# EAGLE design SmartMatrix_V1 (EAGLE 7.2.0)
DATABASE: ./SmartMatrixMVP-PARTSDB.txt
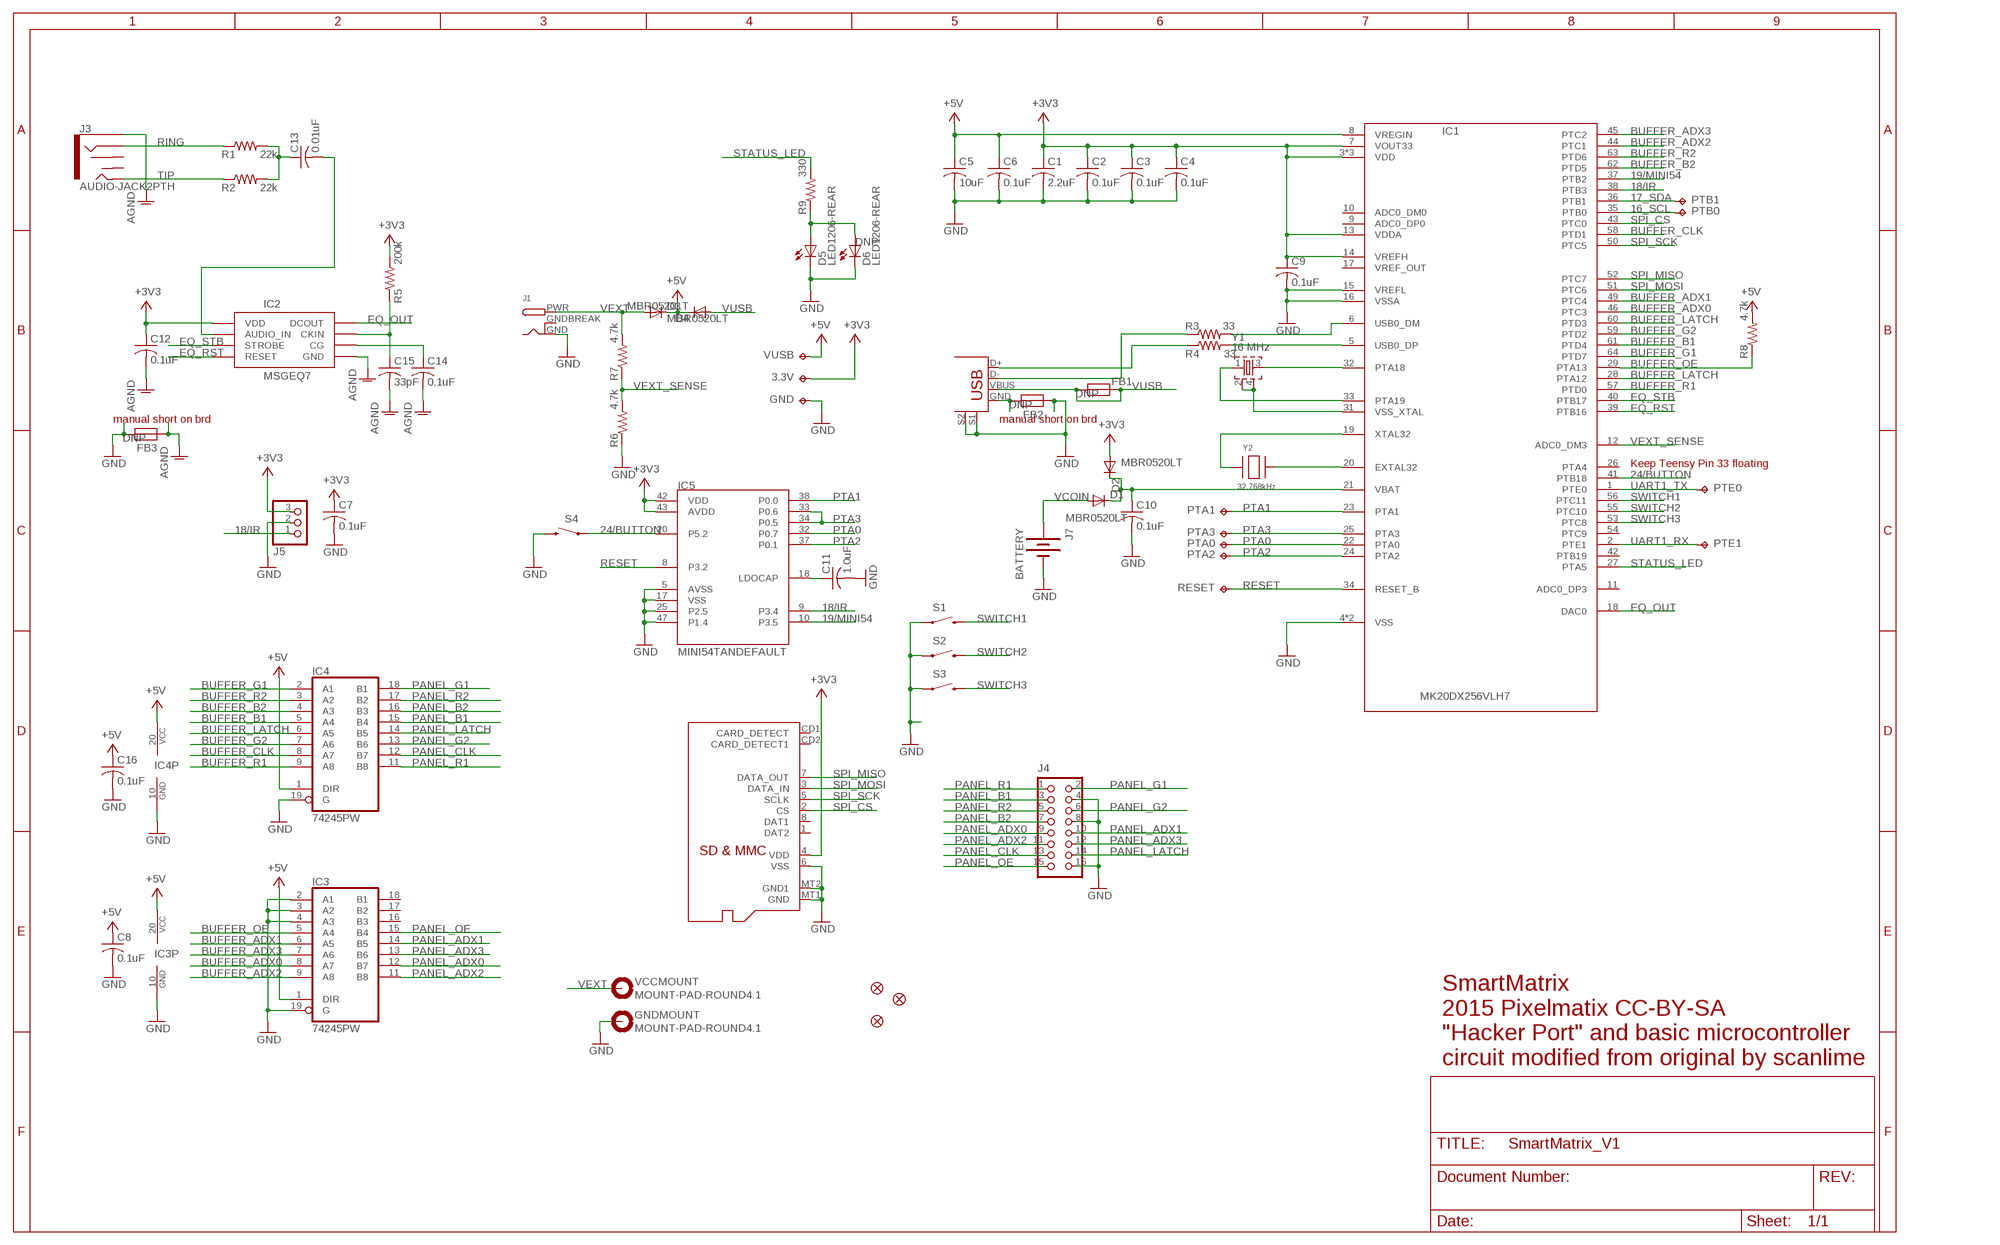
[diagram p0: schematic, sheet 1]

## Parts
3.3V  TPTP18SQ  [TP18SQ]
C1  2.2uF  C-US0805/NO-OUTLINE  [0805]
C2  0.1uF  C-US0805/NO-OUTLINE  [0805]
C3  0.1uF  C-US0805/NO-OUTLINE  [0805]
C4  0.1uF  C-US0805/NO-OUTLINE  [0805]
C5  10uF  C-US0805/NO-OUTLINE  [0805]
C6  0.1uF  C-US0805/NO-OUTLINE  [0805]
C7  0.1uF  C-US0805/NO-OUTLINE  [0805]
C8  0.1uF  C-US0805/NO-OUTLINE  [0805]
C9  0.1uF  C-US0805/NO-OUTLINE  [0805]
C10  0.1uF  C-US0805/NO-OUTLINE  [0805]
C11  1.0uF  C-US0805/NO-OUTLINE  [0805]
C12  0.1uF  C-US0805/NO-OUTLINE  [0805]
C13  0.01uF  C-US0805/NO-OUTLINE  [0805]
C14  0.1uF  C-US0805/NO-OUTLINE  [0805]
C15  33pF  C-US0805/NO-OUTLINE  [0805]
C16  0.1uF  C-US0805/NO-OUTLINE  [0805]
D1  MBR0520LT  [SOD123]
D2  MBR0520LT  [SOD123]
D3  MBR0520LT  [SOD123]
D4  MBR0520LT  [SOD123]
D5  LED1206-REAR  [LED-REARENTRY]
D6  LED1206-REAR  [LED-REARENTRY]
FB1  FB0805/NO-OUTLINE  [0805]
FB2  FB0805/NO-OUTLINE  [0805]
FB3  FB0805/NO-OUTLINE  [0805]
FID1  FIDUCIAL""  [FIDUCIAL_1MM]
FID2  FIDUCIAL""  [FIDUCIAL_1MM]
FID3  FIDUCIAL""  [FIDUCIAL_1MM]
GND  TPTP18SQ  [TP18SQ]
GNDMOUNT  MOUNT-PAD-ROUND4.1  [4,1-PAD]
IC1  MK20DX256VLH7  [MK20DX256VLH7]
IC2  MSGEQ7SOIC  [SOIC8]
IC3  74245PW  [TSSOP-20]
IC4  74245PW  [TSSOP-20]
IC5  MINI54TANDEFAULT  [QFP50P900X900X160-48N]
J1  DCBARRELPTH  [DCJACK_2MM_PTH]
J2  USB+SHIELD  [USB-B-PTH]
J3  AUDIO-JACK2PTH  [AUDIO-JACK]
J4  CON_HEADER_2X08NOA  [2X08-NOA]
J5  CON_HEADER_1X03SMD/90-NOA  [1X03-SMD/90-NOA]
J6  MICROSD  [MICROSD]
J7  BATTERY  [BU2032-SM]
PTA0  TPTP18SQ  [TP18SQ]
PTA1  TPTP18SQ  [TP18SQ]
PTA2  TPTP18SQ  [TP18SQ]
PTA3  TPTP18SQ  [TP18SQ]
PTB0  TPTP18SQ  [TP18SQ]
PTB1  TPTP18SQ  [TP18SQ]
PTE0  TPTP18SQ  [TP18SQ]
PTE1  TPTP18SQ  [TP18SQ]
R1  22k  R-US_0805/NO-OUTLINE  [0805]
R2  22k  R-US_0805/NO-OUTLINE  [0805]
R3  33  R-US_0805/NO-OUTLINE  [0805]
R4  33  R-US_0805/NO-OUTLINE  [0805]
R5  200k  R-US_0805/NO-OUTLINE  [0805]
R6  4.7k  R-US_0805/NO-OUTLINE  [0805]
R7  4.7k  R-US_0805/NO-OUTLINE  [0805]
R8  4.7k  R-US_0805/NO-OUTLINE  [0805]
R9  330  R-US_0805/NO-OUTLINE  [0805]
RESET  TPTP18SQ  [TP18SQ]
S1  SWITCH-MOMENTARY-2PTH  [TACTILE-PTH]
S2  SWITCH-MOMENTARY-2PTH  [TACTILE-PTH]
S3  SWITCH-MOMENTARY-2PTH  [TACTILE-PTH]
S4  SWITCH-MOMENTARY-2PTH  [TACTILE-PTH]
VCCMOUNT  MOUNT-PAD-ROUND4.1  [4,1-PAD]
VUSB  TPTP18SQ  [TP18SQ]
Y1  16 MHz  TSX-32250  [TSX-3225]
Y2  32.768kHz  XTAL-3.2X1.5  [XTAL3215]

## Nets
16_SCL: IC1.35(PTB0) PTB0.TP
17_SDA: IC1.36(PTB1) PTB1.TP
18/IR: IC1.38(PTB3) IC5.9(P3.4) J5.1
19/MINI54: IC1.37(PTB2) IC5.10(P3.5)
24/BUTTON: IC1.41(PTB18) IC5.20(P5.2) S4.1
+3V3: 3.3V.TP C1.1 C2.1 C3.1 C4.1 C7.1 C9.1 C12.1 D2.A IC1.3(VDD) IC1.7(VOUT33) IC1.13(VDDA) IC1.14(VREFH) IC1.30(VDD) IC1.48(VDD) IC2.1(VDD) IC5.42(VDD) IC5.43(AVDD) J5.3 J6.4(VDD) R5.2
+5V: C5.1 C6.1 C8.1 C16.1 D3.C D4.C IC1.8(VREGIN) IC3.1(DIR) IC3.20(VCC) IC4.1(DIR) IC4.20(VCC) R8.2 VUSB.TP
AGND [power]: C12.2 C14.2 C15.2 FB3.2 IC2.2(GND) J3.SLEEVE
BUFFER_ADX0: IC1.46(PTC3) IC3.8(A7)
BUFFER_ADX1: IC1.49(PTC4) IC3.6(A5)
BUFFER_ADX2: IC1.44(PTC1) IC3.9(A8)
BUFFER_ADX3: IC1.45(PTC2) IC3.7(A6)
BUFFER_B1: IC1.61(PTD4) IC4.5(A4)
BUFFER_B2: IC1.62(PTD5) IC4.4(A3)
BUFFER_CLK: IC1.58(PTD1) IC4.8(A7)
BUFFER_G1: IC1.64(PTD7) IC4.2(A1)
BUFFER_G2: IC1.59(PTD2) IC4.7(A6)
BUFFER_LATCH: IC1.28(PTA12) IC1.60(PTD3) IC4.6(A5)
BUFFER_OE: IC1.29(PTA13) IC3.5(A4) R8.1
BUFFER_R1: IC1.57(PTD0) IC4.9(A8)
BUFFER_R2: IC1.63(PTD6) IC4.3(A2)
EQ_OUT: IC1.18(DAC0) IC2.3(DCOUT)
EQ_RST: IC1.39(PTB16) IC2.7(RESET)
EQ_STB: IC1.40(PTB17) IC2.4(STROBE)
GND [power]: C1.2 C2.2 C3.2 C4.2 C5.2 C6.2 C7.2 C8.2 C9.2 C10.2 C11.2 C16.2 D5.-(C) D6.-(C) FB2.2 FB3.1 GND.TP GNDMOUNT.B4,1(MOUNT) IC1.4(VSS) IC1.15(VREFL) IC1.16(VSSA) IC1.47(VSS) IC3.2(A1) IC3.3(A2) IC3.4(A3) IC3.10(GND) IC3.19(G) IC4.10(GND) IC4.19(G) IC5.5(AVSS) IC5.17(VSS) IC5.25(P2.5) IC5.47(P1.4) J1.GND J2.S1 J2.S2 J4.4 J4.8 J4.16 J5.2 J6.6(VSS) J6.MT1(GND) J6.MT2(GND1) J7.- R6.1 S1.1 S2.1 S3.1 S4.3
N$1: C13.1 R1.2 R2.2
N$2: IC1.32(PTA18) Y1.3
N$3 [power]: FB2.1 J2.GND
N$4: IC1.33(PTA19) Y1.1
N$5: C13.2 IC2.5(AUDIO_IN)
N$8: D5.+(A) D6.+(A) R9.1
N$9: J2.D+ R4.1
N$10: J2.D- R3.1
N$11: IC1.6(USB0_DM) R3.2
N$12: IC1.5(USB0_DP) R4.2
N$15: IC1.19(XTAL32) Y2.P$1
N$16: IC1.20(EXTAL32) Y2.P$2
N$18: C15.1 IC2.8(CKIN) R5.1
N$19: C11.1 IC5.18(LDOCAP)
N$22: C14.1 IC2.6(CG)
PANEL_ADX0: IC3.12(B7) J4.9
PANEL_ADX1: IC3.14(B5) J4.10
PANEL_ADX2: IC3.11(B8) J4.11
PANEL_ADX3: IC3.13(B6) J4.12
PANEL_B1: IC4.15(B4) J4.3
PANEL_B2: IC4.16(B3) J4.7
PANEL_CLK: IC4.12(B7) J4.13
PANEL_G1: IC4.18(B1) J4.2
PANEL_G2: IC4.13(B6) J4.6
PANEL_LATCH: IC4.14(B5) J4.14
PANEL_OE: IC3.15(B4) J4.15
PANEL_R1: IC4.11(B8) J4.1
PANEL_R2: IC4.17(B2) J4.5
PTA0: IC1.22(PTA0) IC5.32(P0.7) PTA0.TP
PTA1: IC1.23(PTA1) IC5.38(P0.0) PTA1.TP
PTA2: IC1.24(PTA2) IC5.37(P0.1) PTA2.TP
PTA3: IC1.25(PTA3) IC5.33(P0.6) IC5.34(P0.5) PTA3.TP
RESET: IC1.34(RESET_B) IC5.8(P3.2) RESET.TP
RING: J3.RING R1.1
SPI_CS: IC1.43(PTC0) J6.2(CS)
SPI_MISO: IC1.52(PTC7) J6.7(DATA_OUT)
SPI_MOSI: IC1.51(PTC6) J6.3(DATA_IN)
SPI_SCK: IC1.50(PTC5) J6.5(SCLK)
STATUS_LED: IC1.27(PTA5) R9.2
SWITCH1: IC1.56(PTC11) S1.3
SWITCH2: IC1.55(PTC10) S2.3
SWITCH3: IC1.53(PTC8) S3.3
TIP: J3.TIP R2.1
UART1_RX: IC1.2(PTE1) PTE1.TP
UART1_TX: IC1.1(PTE0) PTE0.TP
VBAT: C10.1 D1.C D2.C IC1.21(VBAT)
VCOIN: D1.A J7.+
VEXT: D3.A J1.PWR R7.2 VCCMOUNT.B4,1(MOUNT)
VEXT_SENSE: IC1.12(ADC0_DM3) R6.2 R7.1
VUSB: D4.A FB1.1 FB1.2 J2.VBUS
XTAL_GND: IC1.31(VSS_XTAL) Y1.2 Y1.4
Unconnected: IC1.9(ADC0_DP0) IC1.10(ADC0_DM0) IC1.11(ADC0_DP3) IC1.17(VREF_OUT) IC1.26(PTA4) IC1.42(PTB19) IC1.54(PTC9) IC3.16(B3) IC3.17(B2) IC3.18(B1) J3.RSH J3.TSH J6.1(DAT2) J6.8(DAT1) J6.CD1(CARD_DETECT) J6.CD2(CARD_DETECT1)

## Notes on the sheet
- manual short on brd | manual short on brd
- Keep Teensy Pin 33 floating
- SmartMatrix
  2015 Pixelmatix CC-BY-SA
  "Hacker Port" and basic microcontroller
  circuit modified from original by scanlime

## Power pins joined to a net without a drawn wire
GNDBREAK: J1.GNDBREAK

## Library data of the parts
3.3V GND PTA0 PTA1-PTA3 PTB0 PTB1 PTE0 PTE1 RESET VUSB = testpad:TP: Test pad; BOM: EXCLUDE
C1 = scanlime:C-US: CAPACITOR, American symbol; PARTNO: CAP CER 2.2UF 10V 10% X7R 0805
C2-C4 C6-C10 C12 C14 C16 = scanlime:C-US: CAPACITOR, American symbol; PARTNO: CAP CER 0.1UF 10V 10% X7R 0805
C5 = scanlime:C-US: CAPACITOR, American symbol; PARTNO: CAP CER 10UF 10V 10% X5R 0805
C11 = scanlime:C-US: CAPACITOR, American symbol; DNP: T; PARTNO: CAP CER 1UF 10V X7R 0805
C13 = scanlime:C-US: CAPACITOR, American symbol; PARTNO: CAP CER 10000PF 50V 10% X7R 0805
C15 = scanlime:C-US: CAPACITOR, American symbol; PARTNO: CAP CER 33PF 50V 5% NP0 0805
D1-D4 = eclibrary:MBR0520LT: SCHOTTKY BARRIER RECTIFIER Source: http://onsemi.com .. MBR0520LT1-D.pdf; PARTNO: MBR0560-TP
D5 = eclibrary:LED; PARTNO: APTR3216YC
D6 = eclibrary:LED; DNP: T
FB1-FB3 = scanlime:FB; DNP: T; PARTNO: RES SMD 0.0 OHM JUMPER 1/8W 0805
FID1-FID3 = microbuilder:FIDUCIAL: Fiducial Alignment Points Various fiducial points for machine vision alignment.; BOM: EXCLUDE
GNDMOUNT VCCMOUNT = eclibrary:MOUNT-PAD-ROUND: MOUNTING PAD, round; BOM: EXCLUDE
IC1 = eclibrary:MK20DX256VLH7: Teensy 3.1 main microcontroller; PARTNO: MK20DX256VLH7
IC2 = msgeq7:MSGEQ7: 7-band graphic equalizer; PARTNO: MSGEQ7N
IC3 IC4 = eclibrary:74*245: Octal BUS TRANSCEIVER, 3-state; PARTNO: SN74AHCT245PWR
IC5 = Teensy_3_Series_Chip_v1.0:MINI54TAN: MINI54TAN Bootloader from PJRC.com, preprogrammed with Teensy 3.0 bootloader. https://www.pjrc.com/store/ic_mini54_tqfp.html; DNP: T
J1 = adafruit:DCBARREL: 2.0mm DC Barrel Jack DCJACK_2MM_PTH - Through Hole Jack (4UConnector: 05537); PARTNO: PJ-002AH
J2 = SparkFun:USB+SHIELD: USB+Shield USB connector with shield pins connectable; PARTNO: E8144-B02022-L
J3 = SparkFun:AUDIO-JACK2; PARTNO: SJ1-3553NG
J4 = eclibrary:CON_HEADER_2X08: 2x07 pin header; PARTNO: 11149
J5 = eclibrary:CON_HEADER_1X03; PARTNO: 11182
J6 = adafruit:MICROSD: Micro-SD / Transflash card holder with SPI pinout For the 3M # 2908-05WB-MG and/or 4UCON #19656 push-push type; PARTNO: 101-00660-68-6
J7 = eclibrary:BATTERY; PARTNO: 05581
R1 R2 = scanlime:R-US_: RESISTOR, American symbol; PARTNO: RES SMD 22K OHM 5% 1/8W 0805
R3 R4 = scanlime:R-US_: RESISTOR, American symbol; PARTNO: RES 33 OHM 1/8W 5% 0805 SMD
R5 = scanlime:R-US_: RESISTOR, American symbol; PARTNO: RES SMD 200K OHM 5% 1/8W 0805
R6-R8 = scanlime:R-US_: RESISTOR, American symbol; PARTNO: RES SMD 4.7K OHM 5% 1/8W 0805
R9 = scanlime:R-US_: RESISTOR, American symbol; PARTNO: RES SMD 330 OHM 5% 1/8W 0805
S1-S4 = SparkFun:SWITCH-MOMENTARY-2; DNP: T
Y1 = scanlime:TSX-3225: MHz RANGE CRYSTAL UNIT Source: Epson Toyocom; PARTNO: TSX-3225 16.0000MF09Z-AC3
Y2 = adafruit:XTAL: Low cost SMT crystals, no capacitors included http://www.ladyada.net/library/eagle; PARTNO: 9HT10-32.768KDZF-T

## Net classes
1 power: width 0.406 mm

## Board
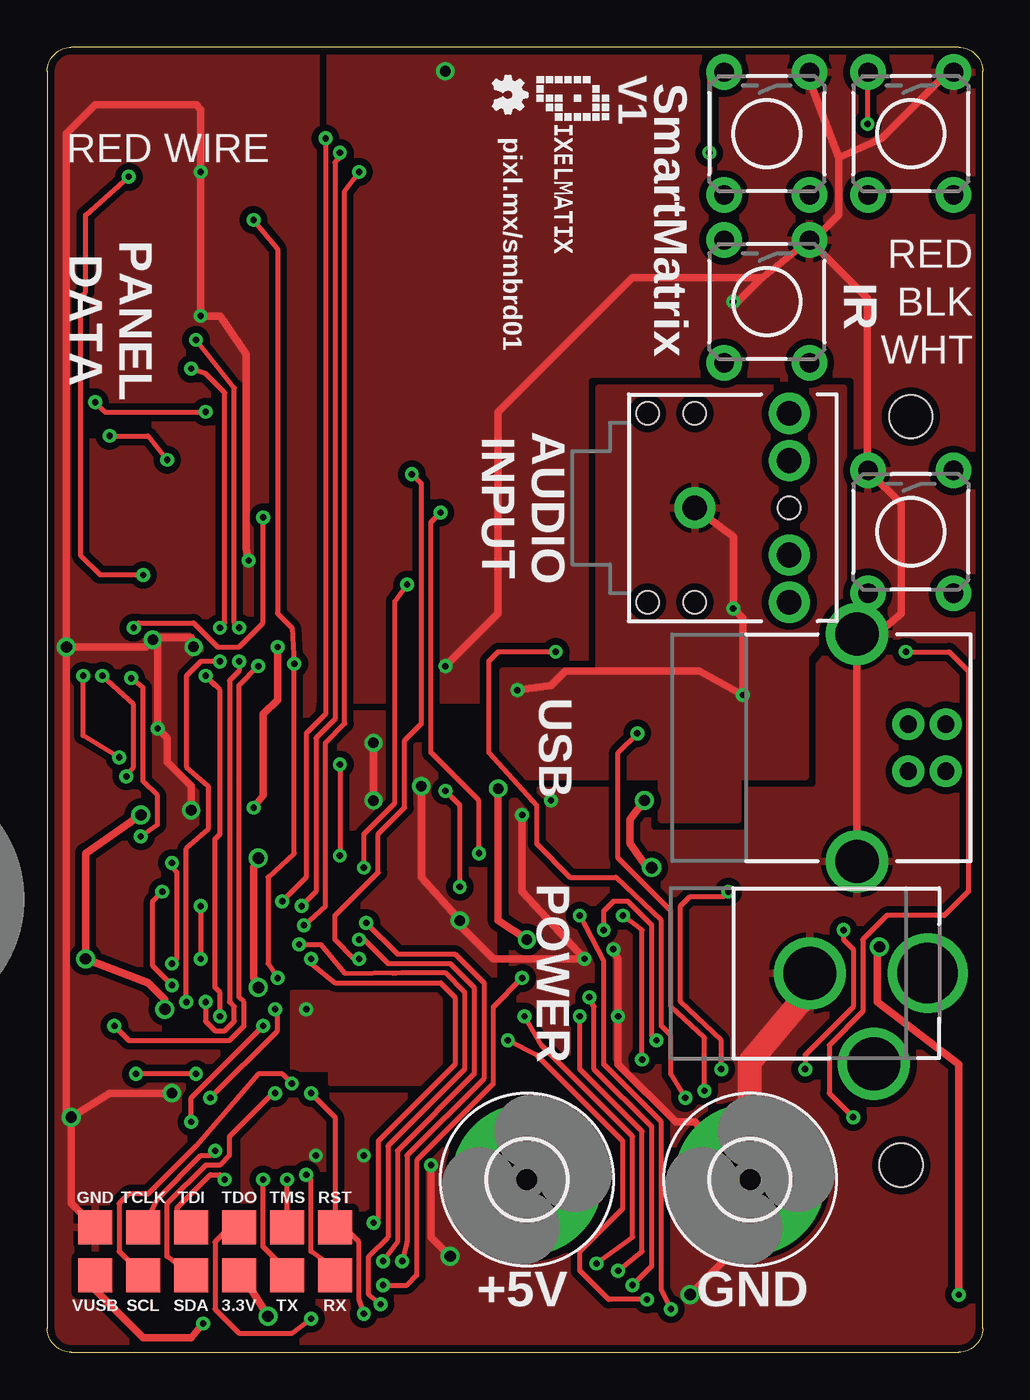
[diagram p1: board, top side]
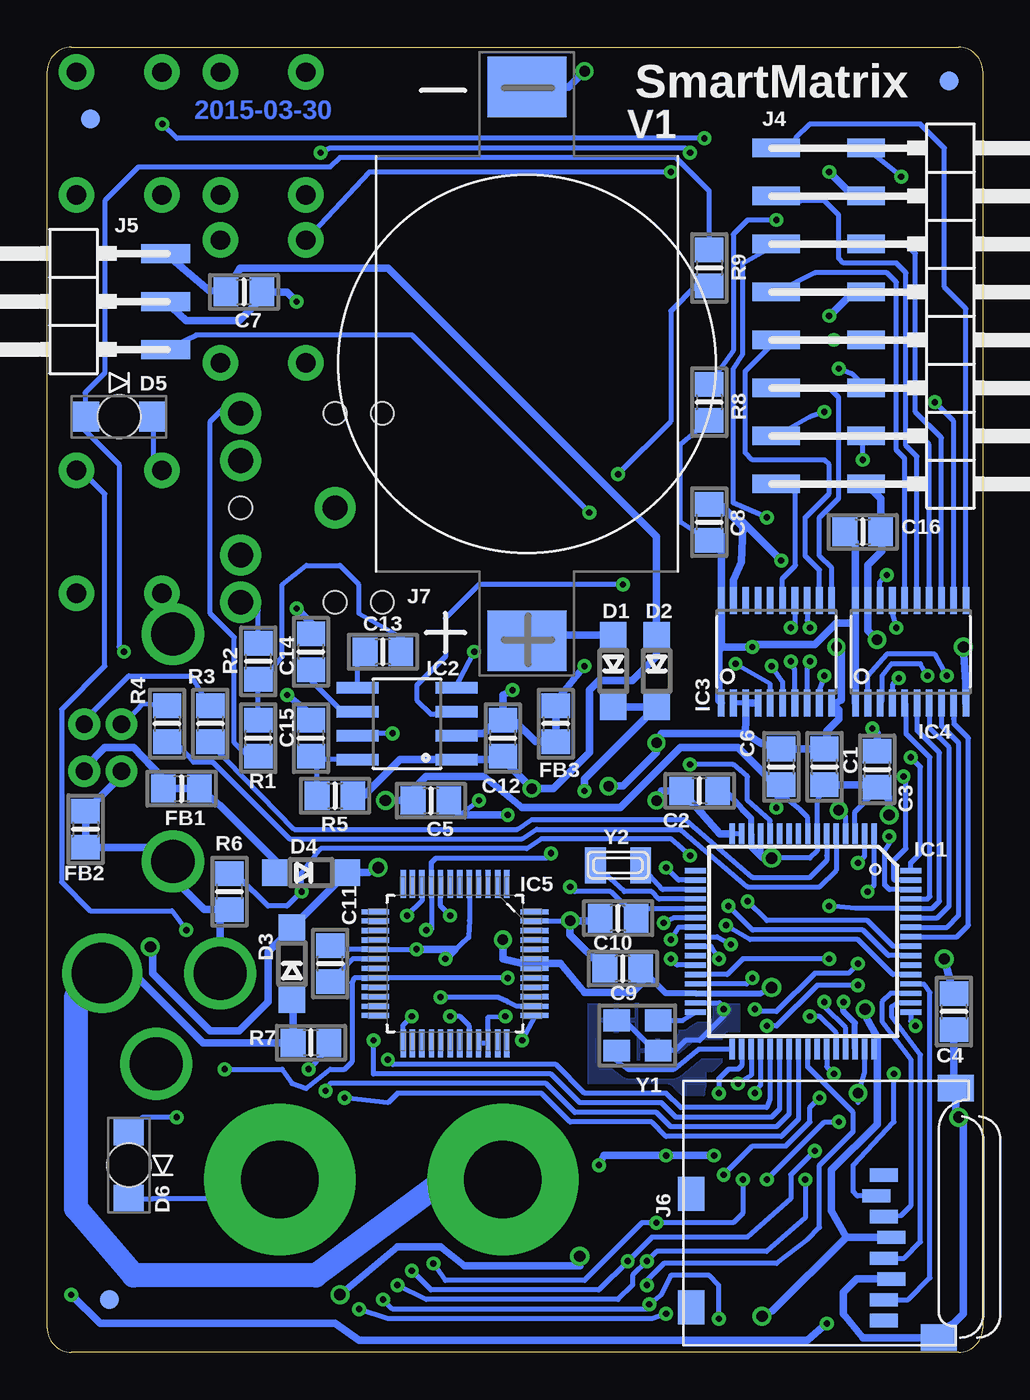
[diagram p2: board, bottom side, seen from below]

Size 49.53 x 69.09 mm. Coordinates in mm from the lower left corner, seen from the top.
Outline: 0,67.82 0,1.27 arc90 1.27,0 48.26,0 arc90 49.53,1.27 49.53,67.82 arc90 48.26,69.09 1.27,69.09 arc90 0,67.82
Copper layers (1*16): Top 0.0356mm / dielectric 1.5011mm / Bottom 0.0356mm
Design rules "OshParkMod-8mil-20150316 *": minimum track width 8mil, minimum drill 13mil, track to track 8mil, track to pad 8mil, pad to pad 8mil, via to via 8mil, smd to smd 8mil, copper to edge 15mil, drill to drill 6mil, minimum pad ring 12mil, minimum via ring 8mil, stop-mask expansion 3mil, vias tented up to drill 25mil, thermal gap 10mil

### Footprints (pad centres in the part's own frame; a part is rotated, then mirrored left to right if it is on the bottom)
TP18SQ = smd 1.8 x 1.8: TP 0,0
0805 = smd 1.3 x 1.5: 1 -0.95,0; 2 0.95,0
SOD123 = smd 1.4 x 1.4: A 1.9,0; C -1.9,0
LED-REARENTRY = smd 1.5 x 1.6: + -1.8,0; - 1.8,0 | hole 2.3: 0,0
FIDUCIAL_1MM = smd 1 x 1: 1 0,0
4,1-PAD = drill 4.1 pad 8: B4,1 0,0
MK20DX256VLH7 = smd 1.1 x 0.285: 1 -5.605,3.385; 2 -5.605,2.885; 3 -5.605,2.385; 4 -5.605,1.885; 5 -5.605,1.385; 6 -5.605,0.885; 7 -5.605,0.385; 8 -5.605,-0.115; 9 -5.605,-0.615; 10 -5.605,-1.115; 11 -5.605,-1.615; 12 -5.605,-2.115; 13 -5.605,-2.615; 14 -5.605,-3.115; 15 -5.605,-3.615; 16 -5.605,-4.115; 33 5.795,-4.115; 34 5.795,-3.615; 35 5.795,-3.115; 36 5.795,-2.615; 37 5.795,-2.115; 38 5.795,-1.615; 39 5.795,-1.115; 40 5.795,-0.615; 41 5.795,-0.115; 42 5.795,0.385; 43 5.795,0.885; 44 5.795,1.385; 45 5.795,1.885; 46 5.795,2.385; 47 5.795,2.885; 48 5.795,3.385 | smd 0.285 x 1.1: 17 -3.655,-6.065; 18 -3.155,-6.065; 19 -2.655,-6.065; 20 -2.155,-6.065; 21 -1.655,-6.065; 22 -1.155,-6.065; 23 -0.655,-6.065; 24 -0.155,-6.065; 25 0.345,-6.065; 26 0.845,-6.065; 27 1.345,-6.065; 28 1.845,-6.065; 29 2.345,-6.065; 30 2.845,-6.065; 31 3.345,-6.065; 32 3.845,-6.065; 49 3.845,5.335; 50 3.345,5.335; 51 2.845,5.335; 52 2.345,5.335; 53 1.845,5.335; 54 1.345,5.335; 55 0.845,5.335; 56 0.345,5.335; 57 -0.155,5.335; 58 -0.655,5.335; 59 -1.155,5.335; 60 -1.655,5.335; 61 -2.155,5.335; 62 -2.655,5.335; 63 -3.155,5.335; 64 -3.655,5.335
SOIC8 = smd 0.61 x 2.21: 1 -1.905,-2.616; 2 -0.635,-2.616; 3 0.635,-2.616; 4 1.905,-2.616; 5 1.905,2.616; 6 0.635,2.616; 7 -0.635,2.616; 8 -1.905,2.616
TSSOP-20 = smd 0.35 x 1.43: 1 -2.925,-2.7; 2 -2.275,-2.7; 3 -1.625,-2.7; 4 -0.975,-2.7; 5 -0.325,-2.7; 6 0.325,-2.7; 7 0.975,-2.7; 8 1.625,-2.7; 9 2.275,-2.7; 10 2.925,-2.7; 11 2.925,2.7; 12 2.275,2.7; 13 1.625,2.7; 14 0.975,2.7; 15 0.325,2.7; 16 -0.325,2.7; 17 -0.975,2.7; 18 -1.625,2.7; 19 -2.275,2.7; 20 -2.925,2.7
QFP50P900X900X160-48N = smd 1.473 x 0.279: 1 -4.216,2.743; 2 -4.216,2.261; 3 -4.216,1.753; 4 -4.216,1.245; 5 -4.216,0.762; 6 -4.216,0.254; 7 -4.216,-0.254; 8 -4.216,-0.762; 9 -4.216,-1.245; 10 -4.216,-1.753; 11 -4.216,-2.261; 12 -4.216,-2.743; 25 4.216,-2.743; 26 4.216,-2.261; 27 4.216,-1.753; 28 4.216,-1.245; 29 4.216,-0.762; 30 4.216,-0.254; 31 4.216,0.254; 32 4.216,0.762; 33 4.216,1.245; 34 4.216,1.753; 35 4.216,2.261; 36 4.216,2.743 | smd 0.279 x 1.473: 13 -2.743,-4.216; 14 -2.261,-4.216; 15 -1.753,-4.216; 16 -1.245,-4.216; 17 -0.762,-4.216; 18 -0.254,-4.216; 19 0.254,-4.216; 20 0.762,-4.216; 21 1.245,-4.216; 22 1.753,-4.216; 23 2.261,-4.216; 24 2.743,-4.216; 37 2.743,4.216; 38 2.261,4.216; 39 1.753,4.216; 40 1.245,4.216; 41 0.762,4.216; 42 0.254,4.216; 43 -0.254,4.216; 44 -0.762,4.216; 45 -1.245,4.216; 46 -1.753,4.216; 47 -2.261,4.216; 48 -2.743,4.216
DCJACK_2MM_PTH = drill 2.8: GND 0,7.35; GNDBREAK 4.8,10.75 | drill 3.2: PWR 0,13.6
USB-B-PTH = drill 0.914 pad 1.676: D+ 0,1.25; D- 1.981,1.25; GND 0,-1.25; VBUS 1.981,-1.25 | drill 2.286: S1 -2.718,-6.02; S2 -2.718,6.02
AUDIO-JACK = drill 1.3 pad 2.184: RING 5,5; RSH 5,2.5; SLEEVE 0,0; TIP 5,-5; TSH 5,-2.5 | hole 1.2: 0,5; -2.5,5; -2.5,-5; 0,-5; 5,0
2X08-NOA = smd 1 x 2.5: 1 -1.27,-9.665; 3 1.27,-9.665; 5 3.81,-9.665; 7 6.35,-9.665; 9 8.89,-9.665; 11 11.43,-9.665; 13 13.97,-9.665; 15 16.51,-9.665 | smd 1 x 2: 2 -1.27,-4.905; 4 1.27,-4.905; 6 3.81,-4.905; 8 6.35,-4.905; 10 8.89,-4.905; 12 11.43,-4.905; 14 13.97,-4.905; 16 16.51,-4.905
1X03-SMD/90-NOA = smd 1 x 2.6: 1 -1.27,-5.5; 2 1.27,-5.5; 3 3.81,-5.5
MICROSD = smd 0.7 x 1.5: 1 9,-10.64; 2 7.9,-10.24; 3 6.8,-10.64; 4 5.7,-11.04; 5 4.6,-10.64; 6 3.5,-11.04; 7 2.4,-10.64; 8 1.3,-10.64 | smd 1.8 x 1.4: CD1 2,-0.44; CD2 8,-0.44 | smd 1.4 x 1.9: MT1 0.4,-13.54; MT2 13.6,-14.44
BU2032-SM = smd 3.2 x 4.2: + -14.65,0; - 14.65,0
TACTILE-PTH = drill 1.016 pad 1.88: 1 -3.251,2.261; 2 3.251,2.261; 3 -3.251,-2.261; 4 3.251,-2.261
TSX-3225 = smd 1.4 x 1.15: 1 -1.1,-0.8; 2 1.1,-0.8; 3 1.1,0.8; 4 -1.1,0.8
XTAL3215 = smd 1.1 x 1.9: P$1 1.2,0; P$2 -1.2,0

### Placement (x,y rotation side)
3.3V  10.16,4.06 0 top
C1  8.38,30.99 90 bottom
C2  14.99,29.72 180 bottom
C3  5.59,30.86 90 bottom
C4  1.52,18.03 270 bottom
C5  29.21,29.21 0 bottom
C6  10.67,30.99 90 bottom
C7  39.12,56.13 0 bottom
C8  14.48,43.94 90 bottom
C9  19.05,20.32 180 bottom
C10  19.3,22.99 180 bottom
C11  34.54,20.57 90 bottom
C12  25.4,32.51 90 bottom
C13  31.75,37.08 180 bottom
C14  35.56,37.08 90 bottom
C15  35.56,32.51 90 bottom
C16  6.35,43.43 0 bottom
D1  19.56,36.07 90 bottom
D2  17.27,36.07 90 bottom
D3  36.58,20.57 270 bottom
D4  35.56,25.4 180 bottom
D5  45.72,49.53 0 bottom
D6  45.21,9.91 270 bottom
FB1  42.42,29.85 0 bottom
FB2  47.5,27.69 270 bottom
FB3  22.61,33.27 270 bottom
FID1  46.23,2.79 0 bottom
FID2  47.24,65.28 0 bottom
FID3  1.78,67.31 0 bottom
GND  2.54,6.6 0 top
GNDMOUNT  37.21,9.14 0 top
IC1  9.14,21.84 270 bottom
IC2  30.48,33.27 90 bottom
IC3  10.92,37.08 0 bottom
IC4  3.81,37.08 0 bottom
IC5  27.94,20.57 270 bottom
J1  33.02,20.07 270 top
J2  45.59,32 0 top
J3  34.29,44.7 0 top
J4  1.27,62.48 270 bottom
J5  48.77,54.36 90 bottom
J6  15.88,0.38 90 bottom
J7  24.13,52.32 90 bottom
PTA0  5.08,6.6 0 top
PTA1  7.62,6.6 0 top
PTA2  10.16,6.6 0 top
PTA3  12.7,6.6 0 top
PTB0  5.08,4.06 0 top
PTB1  7.62,4.06 0 top
PTE0  12.7,4.06 0 top
PTE1  15.24,4.06 0 top
R1  38.35,32.51 90 bottom
R2  38.35,36.58 270 bottom
R3  40.89,33.27 270 bottom
R4  43.18,33.27 270 bottom
R5  34.29,29.46 0 bottom
R6  39.88,24.38 90 bottom
R7  35.56,16.38 180 bottom
R8  14.48,50.29 270 bottom
R9  14.48,57.4 270 bottom
RESET  15.24,6.6 0 top
S1  45.72,64.52 270 top
S2  38.1,64.52 270 top
S3  38.1,55.63 270 top
S4  45.72,43.43 270 top
U$1  [OSHW_FILLX70_NOTEXT]  23.62,67.56 270 top
U$2  [PIXELMATIX-LOGO-SMALL-IMPORT]  25.91,67.56 270 top
VCCMOUNT  25.4,9.14 0 top
VUSB  2.54,4.06 0 top
Y1  18.29,16.76 0 bottom
Y2  19.3,25.78 0 bottom

### Tracks (layer width: path | path; a pad name or v marks a point on that pad's centre or on a via)
16_SCL  (via drill 0.33 pad 0.3)
  Top 0.254: v12.95,14.22 12.45,14.73 11.18,14.73 7.87,10.92 5.33,8.38 4.32,8.38 3.81,7.87 3.81,5.33 PTB0.TP
  Bottom 0.254: IC1.35 12.26,14.66 v12.95,14.22
17_SDA  (via drill 0.33 pad 0.3)
  Top 0.254: PTB1.TP 6.35,5.08 6.35,7.87 8.38,9.91 9.14,9.91 9.65,10.41 9.65,11.43 11.94,13.72 v12.06,13.72 12.19,13.72
  Bottom 0.254: IC1.36 11.76,14.15 v12.06,13.72
18/IR  (via drill 0.33, 0.33 pad 0.3)
  Top 0.254: v32.26,16.51 32,16.76 32,22.61 30.73,23.88 29.97,23.88 29.46,23.37 v29.46,22.35 | v22.86,26.42 22.86,29.21 20.32,31.75 20.32,43.94 v20.83,44.45
  Bottom 0.254: IC1.38 10.76,12.86 11.18,12.45 16.26,12.45 17.02,13.21 21.34,13.21 22.86,14.73 32.26,14.73 v32.26,16.51 | J5.1 41.66,53.85 30.23,53.85 v20.83,44.45 | v29.46,22.35 29.18,22.38 IC5.9 29.18,25.93 28.96,26.16 23.11,26.16 v22.86,26.42
19/MINI54  (via drill 0.33)
  Top 0.254: v31.5,15.49 31.5,22.35 v30.48,23.11
  Bottom 0.254: IC1.37 11.26,13.38 11.43,12.95 16,12.95 16.76,13.72 21.08,13.72 22.61,15.24 31.24,15.24 v31.5,15.49 | IC5.10 29.69,23.9 v30.48,23.11
24/BUTTON  (via drill 0.33)
  Top 0.254: v42.16,22.35 42.16,21.84 42.67,21.34 42.67,18.29 40.13,15.75 v40.13,14.99 | v25.15,19.81 23.62,18.29 23.62,14.22 19.56,10.16 19.56,4.06 19.05,3.56 v17.78,3.56
  Bottom 0.254: v40.13,14.99 37.08,14.99 36.58,14.22 35.81,13.97 34.54,14.99 33.78,14.99 33.4,15.37 33.4,19.56 33.27,19.81 IC5.20 v25.15,19.81 | v42.16,22.35 42.93,23.37 47.24,23.37 48.77,24.89 48.77,34.04 46.48,36.32 46.48,45.44 47.73,46.69 S4.1 | v17.78,3.56 17.78,3.81 16.89,4.7 10.92,4.7 9.26,5.98 8.64,6.6 8.64,9.91 6.86,11.68 6.86,12.7 9.26,15.1 IC1.41
+3V3  (via drill 0.56 pad 0.3, 0.6)
  Top 0.406: v4.95,28.45 2.03,26.42 v2.03,20.83 5.33,19.56 6.22,18.67 v6.22,18.16 | v11.18,19.3 11.18,19.56 10.92,19.81 10.92,25.65 11.18,25.91 v11.18,26.16 | v11.68,1.91 10.67,3.56 3.3V.TP | v25.4,21.84 23.88,22.86 v23.88,29.85
  Bottom 0.254: IC1.3 6.76,28.61 5.59,29.78 | C1.1 8.76,29.15 IC1.7 8.76,26.55 9.14,26.16 v11.18,26.16
  Bottom 0.305: C2.1 13.4,29.46 12.7,28.7 12.26,28.26 IC1.14 12.26,26.74 11.76,26.24 | C9.1 16.78,19 IC1.30 11.73,19 v11.18,19.3 | IC1.48 5.63,16.05 5.59,16 | IC1.13 11.76,26.24 | 11.76,26.24 11.68,26.16 v11.18,26.16 | IC5.42 IC5.43 23.62,20.73 23.62,20.57 | 5.59,29.78 C3.1
  Bottom 0.406: C4.1 v2.03,20.83 | v4.95,28.45 5.01,29.72 C3.1 5.91,30.04 C1.1 | v11.68,1.91 11.12,2.18 7.22,6.09 7.22,6.08 | C9.1 18.03,20.39 18.03,19.56 18.54,19.05 21.08,19.05 22.35,20.57 23.62,20.57 24.38,20.57 25.4,20.83 v25.4,21.84 | R5.2 32.77,29.46 30.86,31.37 IC2.1 25.71,31.37 C12.1 25.08,31.05 v23.88,29.85 22.73,29.85 20.83,31.75 20.83,35.05 20.32,35.56 18.54,35.56 17.27,36.83 D2.A 17.27,43.18 31.5,57.4 39.3,57.4 C7.1 40.95,56.2 J5.3 | v6.22,18.16 6.22,17.82 5.59,16.68 5.59,16 5.59,12.07 8,9.65 8,7.49 7.22,6.08 | J6.4 7.22,6.08
+5V  (via drill 0.33, 0.33 pad 0.3, 0.6)
  Top 0.406: v32,25.65 31.75,25.65 30.86,26.92 30.86,28.19 v31.62,29.21 | VUSB.TP 2.54,3.3 5.08,0.76 7.62,0.76 v8.26,1.52 | v48.26,3.05 48.26,15.24 43.94,18.54 43.94,21.34 v44.07,21.46 | v10.92,28.83 11.43,29.46 11.43,33.78 12.19,34.54 v12.19,37.34
  Bottom 0.254: IC1.8 9.26,28.31 9.65,28.7 10.6,29.46 | C8.1 14.54,42.99 16,43.94 16,48.07 R8.2
  Bottom 0.305: 10.6,29.46 C6.1
  Bottom 0.406: v32,25.65 32.51,25.4 D4.C D3.C 37.85,21.2 37.85,18.54 39.37,17.02 40.89,17.02 43.94,20.07 43.94,21.34 v44.07,21.46 | v31.62,29.21 C5.1 30.23,29.28 30.23,29.72 29.46,30.48 26.42,30.48 24.38,28.83 19.18,28.83 16,32 12.95,32 10.73,29.78 C6.1 v10.92,28.83 | v8.26,1.52 9.27,0.63 33.02,0.63 34.29,1.52 46.74,1.52 v48.26,3.05 | IC4.1 6.74,38.61 | 6.74,38.61 IC4.20 6.74,42.87 C16.1 | IC3.1 13.97,34.51 13.97,37.08 13.85,37.34 | 13.85,37.34 IC3.20 13.85,43.24 C8.1 | 13.85,37.34 v12.19,37.34 12.06,37.47 8.89,37.47 7.75,38.61 6.74,38.61
AGND  (via drill 0.33)
  Top 0.406: J3.SLEEVE 36.32,43.18 v36.32,39.37 36.83,38.86 v36.83,34.8 34.54,36.07 27.43,36.07 26.67,35.31 v24.89,35.05
  Bottom 0.406: FB3.2 23.69,32.32 24.89,33.53 25.33,33.53 C12.2 | C12.2 25.72,33.46 26.42,32.77 27.74,32.77 IC2.2 | C15.2 35.56,33.78 v36.83,34.8 | v36.32,39.37 35.56,38.61 C14.2 | v24.89,35.05 25.4,34.8 C12.2
  pour Top (isolate 0.356): 24.13,30.48 32.51,30.48 32.51,28.19 36.58,28.19 36.58,30.48 40.13,30.48 40.13,36.83 42.16,39.37 42.16,51.05 29.21,51.05 29.21,36.07 24.13,36.07
BUFFER_ADX0  (via drill 0.33 pad 0.3)
  Top 0.254: v9.14,36.58 8.13,36.58 7.37,35.81 7.37,30.99 8.51,29.97 8.51,27.69 7.37,26.67 v7.37,18.54
  Bottom 0.254: IC3.8 9.3,36.17 v9.14,36.58
  Bottom 0.305: IC1.46 6.76,17.43 7.37,18.03 v7.37,18.54
BUFFER_ADX1  (via drill 0.33 pad 0.3)
  Top 0.254: v3.56,17.27 4.32,16.51 9.65,16.51 10.41,17.27 10.41,18.54 10.16,18.8 10.16,35.31 v11.18,36.32
  Bottom 0.254: IC1.49 3.81,17.52 v3.56,17.27 | v11.18,36.32 10.6,35.49 IC3.6
BUFFER_ADX2  (via drill 0.33, 0.33 pad 0.3)
  Top 0.254: 8.89,35.31 v8.38,35.81 9.14,35.05 9.14,27.43 8.89,27.18 8.89,19.3 9.14,19.05 v9.14,17.78
  Bottom 0.254: IC1.44 7.76,16.9 8.64,17.78 v9.14,17.78 | v8.38,35.81 8.64,35.05 8.64,34.4 IC3.9
BUFFER_ADX3  (via drill 0.33 pad 0.3)
  Top 0.254: v8.38,18.54 8.38,17.53 8.89,17.02 9.4,17.02 9.91,17.53 9.91,18.29 9.65,18.54 9.65,35.56 10.16,36.07 v10.16,36.58
  Bottom 0.254: IC1.45 7.26,17.16 8.38,18.29 v8.38,18.54 | IC3.7 9.95,36.11 v10.16,36.58
BUFFER_B1
  Bottom 0.254: IC1.61 2.92,24 2.79,24.13 2.79,31.5 4.06,32.77 4.06,34.31 IC4.5
BUFFER_B2  (via drill 0.33)
  Top 0.254: v4.95,27.3 5.84,27.94 5.84,29.46 5.08,30.23 5.08,35.18 v4.45,35.69
  Bottom 0.254: IC1.62 4.94,24.5 5.21,24.77 5.21,26.54 4.95,26.92 v4.95,27.3 | v4.45,35.69 4.79,35.35 IC4.4
BUFFER_CLK
  Bottom 0.254: IC1.58 1.89,22.5 1.27,23.11 1.27,32.26 2.19,33.17 IC4.8
BUFFER_G1  (via drill 0.33)
  Top 0.254: v3.81,31.5 1.91,32.64 v1.91,35.81
  Bottom 0.254: IC1.64 3.81,25.91 3.3,26.42 3.3,30.99 v3.81,31.5 | v1.91,35.81 2.54,36.96 5.08,36.96 6.1,35.81 6.1,34.4 IC4.2
BUFFER_G2
  Bottom 0.254: IC1.59 2.4,23 1.78,23.62 1.78,32 2.83,33.06 IC4.7
BUFFER_LATCH  (via drill 0.33 pad 0.3)
  Top 0.254: v8.13,23.62 v8.13,20.83
  Bottom 0.254: v8.13,23.62 6.74,23.5 IC1.60 2.66,23.5 2.29,23.88 2.29,31.75 3.48,32.95 IC4.6 | v8.13,20.83 12.7,20.83 13.53,20 IC1.28
BUFFER_OE  (via drill 0.33 pad 0.3)
  Top 0.254: v12.19,19.81 11.68,20.57 11.68,25.15 13.08,26.42 v13.08,36.45 12.95,38.35 12.19,39.12 12.19,58.42 v10.92,59.94
  Bottom 0.254: IC3.5 11.25,35.38 v13.08,36.45 | v12.19,19.81 12.51,19.5 IC1.29 | v10.92,59.94 12.45,59.94 13.21,59.18 13.21,53.02 R8.1
BUFFER_R1
  Bottom 0.254: IC1.57 1.37,22 0.76,22.61 0.76,32.51 1.52,33.27 1.53,33.54 IC4.9 1.52,34.37
BUFFER_R2  (via drill 0.33)
  Top 0.254: v4.19,30.48 4.57,30.99 4.57,34.29 v2.92,35.81
  Bottom 0.254: v4.19,30.48 4.06,30.23 4.06,26.67 4.7,26.04 4.7,25.02 4.68,25 IC1.63 | v2.92,35.81 3.3,36.45 4.83,36.45 5.33,35.81 5.33,34.48 IC4.3
EQ_OUT  (via drill 0.33 pad 0.3)
  Top 0.254: v16.76,25.65 16.76,27.43 18.41,29.08 18.41,39.75 v19.05,40.64
  Bottom 0.254: IC1.18 16.11,25 v16.76,25.65 | v19.05,40.64 26.67,40.64 28.45,38.86 28.45,36.83 29.97,35.31 29.97,34.54 29.21,33.78 27.99,33.78 IC2.3
EQ_RST  (via drill 0.33 pad 0.3)
  Top 0.254: v34.8,13.84 34.8,16.64 33.02,18.29 33.02,23.37 30.23,26.16 30.23,31.75 v31.24,32.77
  Bottom 0.254: IC1.39 10.26,12.6 10.92,11.94 16.51,11.94 17.27,12.7 21.59,12.7 23.11,14.22 34.54,14.22 v34.8,13.84 | v31.24,32.77 32.97,32.77 IC2.7
EQ_STB  (via drill 0.33 pad 0.3)
  Top 0.254: v33.78,13.46 33.02,14.73 33.02,16.76 32.51,17.27 32.51,22.86 30.1,25.15 27.69,25.15 25.91,26.92 25.91,28.96 25.65,29.21 23.37,31.75 23.37,36.58 23.88,37.08 v26.92,37.08
  Bottom 0.254: IC1.40 9.76,12.34 10.67,11.43 16.76,11.43 17.53,12.19 21.84,12.19 23.37,13.72 30.99,13.72 31.5,13.21 v33.78,13.46 | v26.92,37.08 27.99,35.05 IC2.4
GND  (via drill 0.33, 0.33 pad 0.3, 0.56, 0.56 pad 0.56, 0.6)
  Top 0.406: 42.88,37.14 45.21,39.12 45.21,44.93 S4.3 43.43,46.71 43.43,55.8 S3.1 | GND.TP 1.27,7.87 v1.27,12.45 | v1.02,37.34 1.02,12.7 v1.27,12.45 | v5.59,37.72 5.59,37.85 7.62,37.85 v7.75,37.34 | v1.02,37.34 1.02,64.52 2.54,66.04 7.87,66.04 8.13,65.79 v8.13,62.48 v8.13,54.86 9.14,54.86 10.54,52.83 10.54,42.55 v10.67,41.91 | v7.62,28.7 7.62,29.97 6.35,31.24 6.35,32.51 v5.84,33.02 5.84,37.47 v5.59,37.72 | v6.6,13.72 3.3,13.72 v1.27,12.45 | v17.27,29.21 v17.27,32.26 | v29.97,21.34 30.23,20.83 v30.23,17.78 30.23,15.24 33.27,12.19 34.29,12.19 36.07,10.16 37.08,9.14 GNDMOUNT.B4,1 | 37.08,6.1 v34.04,3.05 | v19.81,29.97 19.81,25.15 v21.84,22.86 21.84,22.61 23.62,20.83 v28.45,20.83 25.15,24.38 v25.15,28.45 | S3.1 41.07,59.39 41.91,60.22 41.91,63.25 | J2.S2 42.88,37.14 | 42.88,37.14 J2.S1 | v1.02,37.34 5.21,37.34 v5.59,37.72 | S2.1 40.36,67.34 41.91,63.25 | 41.91,63.25 44.2,64.26 48.01,68.07 48.01,68.25 S1.1 | 37.85,56.9 30.99,56.9 23.88,49.78 23.88,39.12 v21.08,36.32 | 37.85,56.9 37.87,56.9 S3.1 | v21.34,5.08 20.32,6.1 v20.32,9.91 | v36.32,55.63 36.58,55.63 37.85,56.9
  Top 1.27: GNDMOUNT.B4,1 37.21,15.37 39.88,18.54 39.88,19.54 J1.GND
  Bottom 0.254: 34.36,21.34 IC5.17 v29.97,21.34 | IC1.4 7.26,28.34 v7.62,28.7 | IC5.5 27.18,22.86 27.22,22.02 27.22,21.95 v28.45,20.83 | IC5.25 30.68,17.32 v30.23,17.78 | IC5.47 21.87,22.83 | IC1.47 6.26,14.82 v6.6,13.72 6.6,13.21 | IC1.15 IC1.16 | v26.67,29.21 27.69,28.45 | D5.- 43.92,47.15 S4.3 | GNDMOUNT.B4,1 38.23,8.13 43.94,8.13 | 45.21,8.13 43.94,8.13 | 43.94,8.13 43.96,8.11 D6.- | IC3.3 IC3.2
  Bottom 0.305: IC1.16 13.45,27.45 13.46,27.43
  Bottom 0.406: FB2.2 43.63,26.74 J2.S1 42.93,25.93 42.93,25.15 41.21,23.43 R6.1 40.37,22.94 J1.GND | 34.36,21.34 C11.2 | C4.2 1.52,14.65 J6.MT2 1.44,12.74 v1.27,12.45 1.02,12.19 1.02,2.03 1.52,1.52 2.86,0.76 J6.MT1 2.61,0.76 6.35,0.76 7.37,2.03 7.37,3.17 6.66,3.88 J6.6 | IC4.10 0.89,35.43 v1.02,37.34 | C3.2 5.59,32.77 v5.84,33.02 | v5.59,37.72 6.08,38.22 IC4.19 6.08,41.67 5.33,42.42 5.33,43.37 C16.2 5.4,45.2 J4.16 | IC3.19 13.21,40.89 12.77,41.84 12.7,43.69 13.9,44.89 C8.2 12.7,43.94 v10.67,41.91 | IC3.4 IC3.3 12.55,33.56 12.57,32.77 | 20.07,20.25 C9.2 20.07,20.32 21.84,22.1 v21.84,22.86 | 20.57,23.11 C10.2 20.53,22.83 21.82,22.83 v21.84,22.86 | v17.27,29.21 17.02,29.72 C2.2 13.92,27.45 13.9,27.43 13.46,27.43 | 12.57,32.77 17.02,32.77 v17.27,32.26 17.27,31.75 19.05,29.97 v19.81,29.97 | 12.57,32.77 11.72,32.23 C6.2 C1.2 8.25,31.82 8.25,32.9 7.62,33.53 7.62,34.01 IC3.10 7.78,34.38 7.49,34.54 7.49,37.08 v7.75,37.34 | v28.45,20.83 27.94,21.34 v29.97,21.34 | v34.04,3.05 30.99,5.59 28.7,5.59 27.43,4.57 21.34,4.57 v21.34,5.08 | 21.87,22.83 v21.84,22.86 | 24.21,67.06 J7.- 21.93,66.97 v21.08,67.82 | J4.4 6.86,61.21 v8.13,62.48 | J4.8 6.86,56.13 v8.13,54.86 | C5.2 27.69,28.45 v25.15,28.45 | FB3.1 22.79,34.22 v21.08,36.32 | v20.32,9.91 20.07,10.41 v16.76,10.41 v14.22,10.41 | J5.2 42.16,54.61 39.37,54.61 38.17,55.81 C7.2 36.83,56.13 v36.32,55.63
  pour Top (isolate 0.356, rank 2): 14.99,69.09 14.99,34.54 23.88,34.54 23.88,36.58 28.7,36.58 28.7,51.56 42.67,51.56 42.67,36.83 40.64,36.83 40.64,29.97 37.08,29.97 37.08,27.69 32.26,27.69 32.26,29.97 24.64,29.97 24.64,13.97 10.41,13.97 10.41,0.25 49.53,0.25 49.53,69.09
  pour Top (isolate 0.356, rank 2): 14.22,68.83 0.25,68.83 0.25,0.25 9.65,0.25 9.65,14.22 12.7,14.22 12.7,19.05 23.62,19.05 23.62,33.78 13.97,33.78 14.22,35.56
N$1
  Bottom 0.254: R1.2 R2.2 38.03,35.63 37.08,36.83 37.08,40.64 35.81,41.66 34.04,41.66 33.02,40.64 33.02,39.12 30.73,37.85 30.73,37.15 C13.1
N$2
  Bottom 0.254: Y1.3 15.9,17.56 IC1.32
N$3
  Bottom 0.406: FB2.1 45.59,30.54 J2.GND
N$4
  Bottom 0.254: Y1.1 19.77,15.71 18.8,14.99 16.35,14.99 15.04,16.05 IC1.33
N$5
  Bottom 0.254: IC2.5 33.1,36.69 C13.2
N$7
  Bottom 0.406: 47.5,26.92 47.5,28.45
N$8  (via drill 0.33)
  Top 0.254: v42.67,12.45 41.4,13.72 41.4,16.26 43.18,18.03 43.18,21.84 44.45,23.11 47.5,23.11 48.77,24.38 48.77,36.07 47.75,37.08 v45.47,37.08
  Bottom 0.254: R9.1 14.48,61.47 16.26,63.25 34.04,63.25 34.54,62.74 44.7,62.74 46.48,60.96 46.48,51.84 47.52,50.8 D5.+ 47.52,48.79 45.72,46.99 45.72,37.34 v45.47,37.08 | v42.67,12.45 44.47,12.45 D6.+
N$9
  Bottom 0.254: J2.D+ 45.72,33.27 45.21,33.53 44.45,34.36 R4.1
N$10
  Bottom 0.254: J2.D- 47.7,33.33 45.21,35.81 41.91,35.81 41.15,34.54 41.15,34.36 R3.1
N$11
  Bottom 0.254: IC1.6 8.26,26.29 8.26,26.04 9.14,25.15 12.19,25.15 15.75,28.19 23.88,28.19 24.64,27.69 36.45,27.69 40.89,32.26 R3.2
N$12
  Bottom 0.254: IC1.5 7.76,25.52 8.64,24.64 12.45,24.64 16,27.69 23.62,27.69 24.38,27.18 36.7,27.18 40.77,31.24 41.78,31.24 43.18,32.77 R4.2
N$15
  Bottom 0.254: IC1.19 16.95,24.5 Y2.P$1
N$16
  Bottom 0.254: IC1.20 17.14,24 17.53,24.38 18.98,24.38 Y2.P$2
N$17
  Bottom 0.406: 22.61,32.51 22.61,34.29
N$18
  Bottom 0.254: IC2.8 35.11,31.37 C15.1 35.24,31.5 R5.1
N$19
  Bottom 0.254: IC5.18 33.34,20.83 C11.1
N$22
  Bottom 0.254: IC2.6 33.91,33.91 35.56,35.56 C14.1
PANEL_ADX0
  Bottom 0.254: IC3.12 8.65,41.41 9.4,42.16 9.4,44.2 8.13,45.47 8.13,46.99 8.38,47.24 12.19,47.24 12.57,47.62 12.57,51.93 J4.9
PANEL_ADX1  (via drill 0.33)
  Top 0.254: v10.16,38.35 9.91,38.61 9.91,51.05 v7.87,53.59
  Bottom 0.254: IC3.14 9.95,38.4 v10.16,38.35 | v7.87,53.59 J4.10
PANEL_ADX2
  Bottom 0.254: IC3.11 8,41.53 8.64,42.16 8.64,44.2 7.62,45.21 7.62,50.55 8.13,51.05 J4.11
PANEL_ADX3  (via drill 0.33)
  Top 0.254: v9.14,38.35 9.4,38.61 9.4,50.8 8.38,51.82 v7.62,52.07
  Bottom 0.254: IC3.13 9.3,38.76 v9.14,38.35 | v7.62,52.07 6.94,51.82 J4.12
PANEL_B1
  Bottom 0.254: IC4.15 3.48,47.43 4.06,48.01 4.06,57.15 4.57,57.66 7.37,57.66 7.62,57.91 7.62,60.2 8.38,60.96 9.64,60.96 J4.3
PANEL_B2
  Bottom 0.254: IC4.16 4.13,47.32 4.57,47.75 4.57,56.64 5.08,57.15 8.88,57.15 J4.7
PANEL_CLK  (via drill 0.33)
  Top 0.254: v2.54,50.29 3.05,49.78 v8.38,49.78
  Bottom 0.254: IC4.12 1.53,49.29 v2.54,50.29 | v8.38,49.78 9.13,49.53 J4.13
PANEL_G1  (via drill 0.33)
  Top 0.254: v5.08,41.15 2.79,41.15 1.78,42.16 1.78,55.88 2.03,56.13 2.03,60.2 v4.32,62.23
  Bottom 0.254: IC4.18 5.43,40.79 v5.08,41.15 | v4.32,62.23 J4.2
PANEL_G2
  Bottom 0.254: IC4.13 2.19,48.41 3.56,49.78 3.56,58.17 4.06,58.67 J4.6
PANEL_LATCH  (via drill 0.33)
  Top 0.254: v3.3,48.51 5.33,48.51 v6.35,47.24
  Bottom 0.254: IC4.14 2.83,48.05 v3.3,48.51 | v6.35,47.24 6.35,48.34 J4.14
PANEL_OE
  Bottom 0.254: IC3.15 10.6,40.97 9.91,41.66 9.91,45.96 J4.15
PANEL_R1
  Bottom 0.254: IC4.11 0.89,55.24 2.03,56.39 2.03,63.75 3.3,65.02 9.14,65.02 9.91,64.26 9.91,63.77 J4.1
PANEL_R2  (via drill 0.33)
  Top 0.254: v11.43,44.2 11.43,38.61 10.16,37.34 9.02,37.34 7.75,38.61 4.83,38.61 v4.57,38.35
  Bottom 0.254: IC4.17 4.79,39.08 v4.57,38.35 | v11.43,44.2 13.21,44.96 13.21,52.07 12.7,52.83 12.7,57.66 J4.5
PTA0  (via drill 0.33, 0.33 pad 0.3)
  Top 0.254: v30.23,4.32 31.5,5.33 31.5,11.68 28.19,14.99 v28.19,17.78 | v16.89,22.73 18.54,21.08 21.59,21.08 23.11,19.56 23.11,14.48 19.05,10.41 19.05,5.84 v18.8,4.83 | PTA0.TP 5.84,8.13 8.13,10.41 8.64,10.41 v8.89,10.67
  Bottom 0.254: IC1.22 16.37,23 v16.89,22.73 | IC5.32 27.18,17.27 27.69,17.78 v28.19,17.78 | v30.23,4.32 29.21,3.3 20.32,3.3 v18.8,4.83 17.53,6.1 12.45,6.1 10.16,8.13 10.16,9.4 v8.89,10.67
PTA1  (via drill 0.33, 0.33 pad 0.3)
  Top 0.254: PTA1.TP 7.37,6.6 6.86,7.62 8.64,9.4 9.14,9.4 v9.4,9.14 | v30.99,3.56 32,4.57 32,11.94 28.96,14.99 28.96,18.29 v28.7,18.8 | v16.51,21.84 16.76,21.84 18.03,20.57 21.34,20.57 22.61,19.3 22.61,14.73 18.54,10.67 18.54,5.84 v17.78,4.83
  Bottom 0.254: v30.99,3.56 29.46,2.79 19.3,2.79 18.54,3.56 18.54,4.06 v17.78,4.83 17.27,5.33 11.43,5.33 9.4,7.11 v9.4,9.14 | IC5.38 24.66,18.31 25.15,18.54 25.65,18.8 v28.7,18.8 | IC1.23 16.11,22.5 v16.51,21.84
PTA2  (via drill 0.33, 0.33 pad 0.3)
  Top 0.254: v13.34,21.59 14.48,21.59 15.75,20.07 18.78,20.1 | v31.75,2.79 29.72,2.79 28.19,4.32 28.19,5.33 30.48,7.62 30.48,11.18 25.91,15.75 v24.38,16.51 | 18.29,20.07 18.78,20.1 | PTA2.TP 9.65,6.6 8.89,5.84 8.89,2.29 10.16,1.02 12.95,1.02 v13.97,1.78 | v17.65,2.54 17.02,3.05 17.02,5.08 18.03,6.1 18.03,10.92 22.1,14.99 22.1,19.05 21.05,20.1 18.78,20.1
  Bottom 0.254: IC1.24 14.07,22 v13.34,21.59 | v24.38,16.51 23.67,17.83 IC5.37 | v31.75,2.79 31.24,2.29 17.78,2.29 v17.65,2.54 17.02,3.05 16.51,4.06 14.48,4.06 13.97,3.56 v13.97,1.78
PTA3  (via drill 0.33, 0.33 pad 0.3)
  Top 0.254: v29.08,4.7 30.99,6.1 30.99,11.43 26.16,16.26 v25.27,17.78 | PTA3.TP v12.7,9.14 | v13.97,20.83 13.97,20.57 15.24,19.56 20.83,19.56 21.59,18.8 21.59,15.24 17.53,11.18 17.53,7.11 v17.27,6.86
  Bottom 0.254: IC1.25 14.39,21.5 v13.97,20.83 | v29.08,4.7 28.45,3.81 21.08,3.81 18.03,6.86 v17.27,6.86 13.21,6.86 12.7,7.37 v12.7,9.14 | IC5.33 IC5.34 26.19,17.75 v25.27,17.78
RESET  (via drill 0.33 pad 0.3)
  Top 0.254: v13.97,13.72 15.24,12.45 RESET.TP 15.75,6.6 16.51,5.84 16.51,2.79 v16.76,2.03 | v28.19,23.11 29.46,20.7 29.46,15.24 32.51,12.19 32.51,3.3 v33.02,2.29
  Bottom 0.254: IC1.34 12.76,15.18 12.95,14.99 13.46,14.99 13.97,14.48 v13.97,13.72 | v28.19,23.11 28.7,23.62 IC5.8 | v16.76,2.03 17.53,1.78 31.5,1.78 v33.02,2.29
RING
  Bottom 0.254: R1.1 38.93,31.56 39.62,32.26 39.62,37.85 40.89,39.12 40.89,49.28 39.88,50.29 39.37,50.29 J3.RING
SPI_CS  (via drill 0.33 pad 0.3)
  Top 0.254: v7.87,14.73 v4.7,14.73
  Bottom 0.254: IC1.43 8.26,15.12 v7.87,14.73 | J6.2 6.63,8.28 6.86,8.51 6.86,9.91 4.7,12.19 v4.7,14.73
SPI_MISO
  Bottom 0.254: IC1.52 3.11,19.5 2.79,19.05 2.79,3.94 3.95,2.78 J6.7
SPI_MOSI
  Bottom 0.254: IC1.51 4.88,19 5.33,18.54 5.33,17.53 3.81,15.49 3.81,7.75 4.32,7.24 J6.3
SPI_SCK
  Bottom 0.254: IC1.50 4.53,18.5 4.83,18.29 4.83,17.78 3.3,15.75 3.3,5.84 4.16,4.98 J6.5
STATUS_LED  (via drill 0.33)
  Top 0.254: v16.51,20.83 16.26,20.83 15.24,21.84 15.24,23.11 17.53,25.4 17.53,27.43 18.92,28.83 18.92,32.39 19.81,33.27 19.81,45.97 v19.3,46.48
  Bottom 0.254: IC1.27 16.18,20.5 v16.51,20.83 | R9.2 15.17,56.45 16.51,55.12 16.51,49.28 v19.3,46.48
SWITCH1  (via drill 0.33 pad 0.3)
  Top 0.254: v12.45,23.88 13.72,25.15 13.72,32.77 14.73,33.78 v14.73,64.26 | v43.43,65.02 43.46,65.05 S1.3
  Bottom 0.254: IC1.56 4.74,21.5 6.1,22.86 11.43,22.86 v12.45,23.88 | v14.73,64.26 42.67,64.26 v43.43,65.02
SWITCH2  (via drill 0.33 pad 0.3)
  Top 0.254: v13.46,23.62 14.22,24.38 14.22,32.51 15.24,33.53 15.24,62.99 15.49,63.25 v15.49,63.5 | S2.3 35.05,67.49 v35.05,63.5
  Bottom 0.254: IC1.55 5,21 6.35,22.35 12.19,22.35 v13.46,23.62 | v35.05,63.5 34.54,63.75 15.75,63.75 v15.49,63.5
SWITCH3  (via drill 0.33 pad 0.3)
  Top 0.254: v13.59,22.61 14.73,23.62 14.73,32.26 15.75,33.27 15.75,61.47 v16.51,62.48
  Bottom 0.254: IC1.53 4.76,20 6.6,21.84 12.32,21.84 v13.59,22.61 | v16.51,62.48 32.49,62.48 S3.3
TIP
  Bottom 0.254: R2.1 38.35,39.28 J3.TIP
UART1_RX  (via drill 0.33, 0.33 pad 0.3)
  Top 0.254: 14.99,4.06 PTE1.TP 15.75,4.06 13.97,5.33 13.97,9.14 v13.72,9.4 | v6.6,25.91 6.6,25.65 6.86,25.4 6.86,20.83 v6.6,20.57 | v8.64,13.46 12.19,17.02 12.19,17.78 12.19,18.03 v12.06,18.16
  Bottom 0.254: IC1.2 6.26,26.25 v6.6,25.91 | v6.6,20.57 7.11,20.07 8.89,20.07 10.92,18.03 11.94,18.03 v12.06,18.16 | v13.72,9.4 12.19,10.92 10.41,10.92 9.14,12.19 9.14,12.95 v8.64,13.46
UART1_TX  (via drill 0.33, 0.33 pad 0.3)
  Top 0.254: v6.6,19.43 5.59,20.45 5.59,23.88 v6.1,24.38 | PTE0.TP 12.95,4.06 11.43,5.59 v11.43,9.14 | v7.62,12.19 7.62,13.46 v11.43,17.27
  Bottom 0.254: v6.6,19.43 8.76,19.43 10.92,17.27 v11.43,17.27 | IC1.1 5.76,24.72 6.22,24.26 6.22,24.51 v6.1,24.38 | v11.43,9.14 8.38,12.19 v7.62,12.19
VBAT  (via drill 0.33 pad 0.3)
  Top 0.254: v21.84,24.64 21.84,28.96 v21.08,29.72
  Bottom 0.254: v21.84,24.64 21.59,24.38 19.68,24.38 18.41,23.11 C10.1 | 17.97,23.5 IC1.21
  Bottom 0.406: 17.97,23.5 C10.1 | v21.08,29.72 21.08,30.36 D2.C D1.C
VCOIN
  Bottom 0.254: 23.58,38.22 J7.+
  Bottom 0.406: D1.A 23.88,37.98 J7.+
VEXT
  Bottom 0.406: J1.PWR 44.96,20.07 41.27,16.38 R7.2 36.51,18.61 D3.A
  Bottom 1.27: VCCMOUNT.B4,1 28.45,9.14 35.31,4.06 44.96,4.06 48.01,7.62 48.01,18.8 J1.PWR
VEXT_SENSE  (via drill 0.33 pad 0.3)
  Top 0.254: v15.49,31.11 v15.49,26.29 | v35.69,14.99 35.69,16.51 33.53,18.54 33.53,23.62 34.04,24.13 35.81,24.13 v36.07,24.38
  Bottom 0.254: IC1.12 11.26,28.15 12.45,29.21 12.45,30.48 13.21,31.11 v15.49,31.11 | v15.49,26.29 16.51,27.18 23.37,27.18 24.13,26.67 35.05,26.67 36.07,25.4 v36.07,24.38 36.83,23.62 37.85,23.62 39.37,25.15 39.69,25.15 R6.2 | R7.1 34.86,15.81 v35.69,14.99
VUSB
  Bottom 0.406: D4.A 37.34,25.52 37.34,25.91 40.39,28.96 FB1.2 FB1.1 43.49,30.48 44.96,32 46.48,32 47.52,30.97 47.52,30.75 J2.VBUS
XTAL_GND  (via drill 0.33)
  Bottom 0.254: IC1.31 13.93,18.5 v13.72,18.16 13.72,17.78 14.99,16.51 15.75,16.51 16.26,16 17.15,16 Y1.2 17.49,15.71 17.49,16.09 18.92,17.53 19.35,17.53 Y1.4
  pour Top (isolate 0.356): 12.95,19.05 12.95,14.99 14.99,14.99 14.99,14.22 20.83,14.22 20.83,19.05
  pour Bottom (isolate 0.356): 12.95,19.05 20.83,19.05 20.83,13.72 14.73,13.72 14.73,14.99 12.95,14.99

### Text on the board
Bottom: 2015-03-30
tPlace: V1 | RED WIRE | SmartMatrix | pixl.mx/smbrd01 | RED | IR | BLK | PANEL / DATA | WHT | AUDIO / INPUT | USB | POWER | GND | TCLK | TDI | TDO | TMS | RST | +5V | GND | VUSB | SCL | SDA | 3.3V | TX | RX
bPlace: SmartMatrix | V1 | J7
Document: .02" for IDC / inc protrusion | .01" for IDC Clearance | SmartMatrix / 2015 Pixelmatix CC-BY-SA / "Hacker Port" and basic microcontroller / circuit modified from original by scanlime | 2.4" to frame (2.43" actual) | 7mm for IDC
tDocu: 7.5-8mm clearance under board